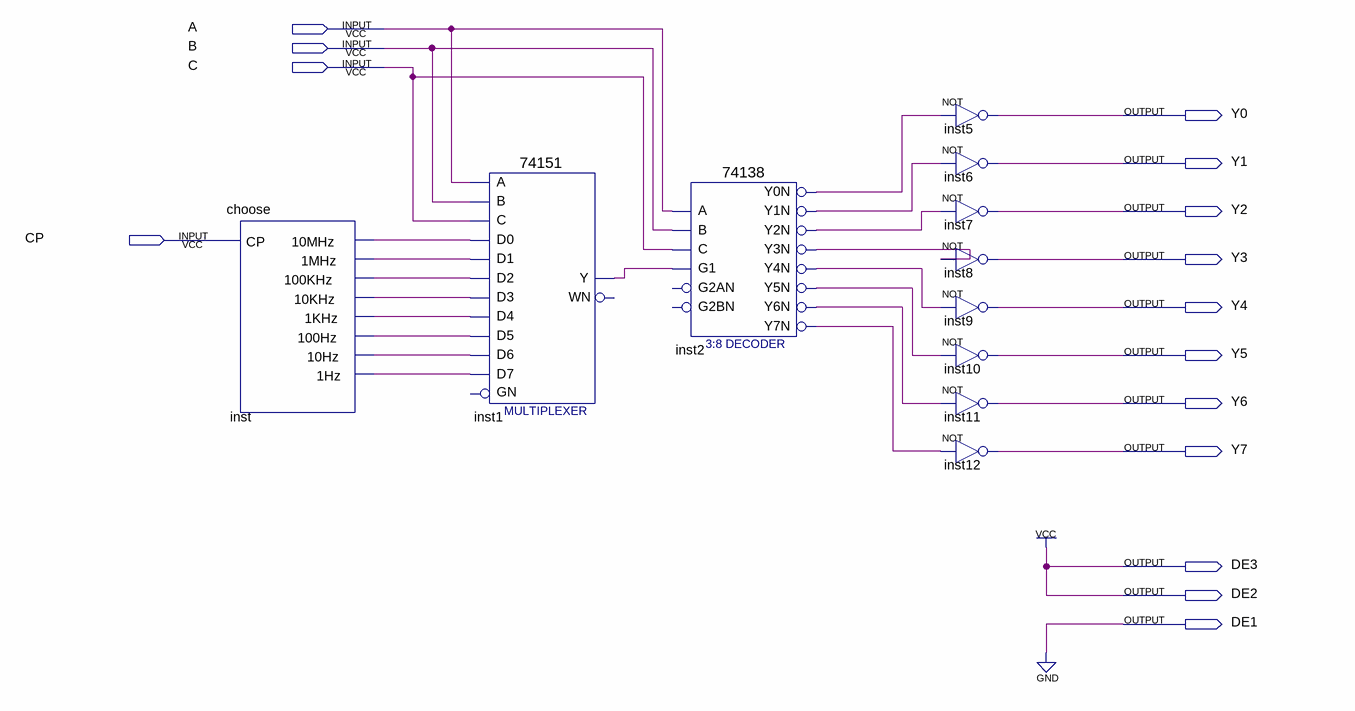
[diagram p0: schematic sheet]
// Quartus schematic choose1.bdf as structural Verilog: 11 symbols, 15 pins
module choose1 (
  input  A,
  input  B,
  input  C,
  input  CP,
  output Y0,
  output Y1,
  output Y2,
  output Y3,
  output Y4,
  output Y5,
  output Y6,
  output Y7,
  output DE3,
  output DE2,
  output DE1
);

  wire inst1_y, inst2_y0n, inst2_y1n, inst2_y2n, inst2_y3n, inst2_y4n, inst2_y5n, inst2_y6n, inst2_y7n,
       inst_1hz, inst_1khz, inst_1mhz, inst_10hz, inst_10khz, inst_10mhz, inst_100hz, inst_100khz;

  choose inst (
    .CP(CP), .\10MHz (inst_10mhz), .\1MHz (inst_1mhz), .\100KHz (inst_100khz), .\10KHz (inst_10khz),
    .\1KHz (inst_1khz), .\100Hz (inst_100hz), .\10Hz (inst_10hz), .\1Hz (inst_1hz));
  \74151  inst1 (
    .C(C), .B(B), .A(A), .D5(inst_100hz), .D0(inst_10mhz), .D1(inst_1mhz), .D4(inst_1khz), .D3(inst_10khz),
    .D2(inst_100khz), .D6(inst_10hz), .D7(inst_1hz), .Y(inst1_y));  // open: GN, WN
  \74138  inst2 (
    .A(A), .B(B), .G1(inst1_y), .C(C), .Y0N(inst2_y0n), .Y1N(inst2_y1n), .Y2N(inst2_y2n), .Y3N(inst2_y3n),
    .Y4N(inst2_y4n), .Y5N(inst2_y5n), .Y6N(inst2_y6n), .Y7N(inst2_y7n));  // open: G2AN, G2BN
  not inst5 (Y0, inst2_y0n);
  not inst6 (Y1, inst2_y1n);
  not inst7 (Y2, inst2_y2n);
  not inst8 (Y3, inst2_y3n);
  not inst9 (Y4, inst2_y4n);
  not inst10 (Y5, inst2_y5n);
  not inst11 (Y6, inst2_y6n);
  not inst12 (Y7, inst2_y7n);

  assign DE1 = 1'b0;
  assign DE2 = 1'b1;
  assign DE3 = 1'b1;
endmodule
